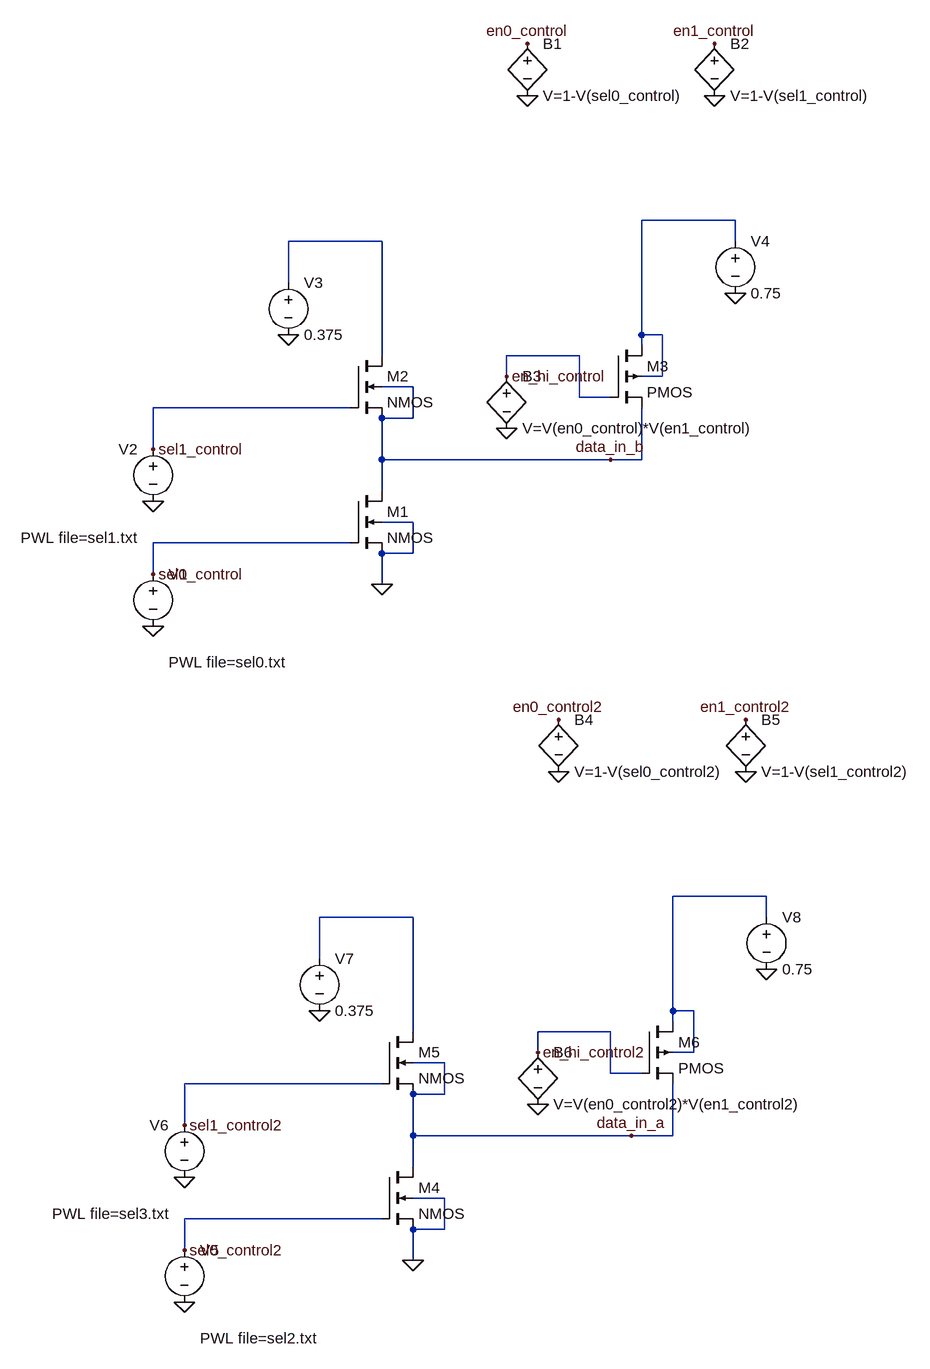
[diagram p0: schematic Draft4.asc]
Draft4.asc, the LTspice schematic file:
Version 4
SHEET 1 880 1244
WIRE 368 -544 224 -544
WIRE -176 -512 -320 -512
WIRE 368 -512 368 -544
WIRE -320 -448 -320 -512
WIRE 224 -368 224 -544
WIRE 256 -368 224 -368
WIRE 224 -352 224 -368
WIRE -176 -336 -176 -512
WIRE 128 -336 16 -336
WIRE 16 -304 16 -336
WIRE 256 -304 256 -368
WIRE 256 -304 224 -304
WIRE -128 -288 -176 -288
WIRE 128 -272 128 -336
WIRE 176 -272 128 -272
WIRE -224 -256 -528 -256
WIRE -128 -240 -128 -288
WIRE -128 -240 -176 -240
WIRE -528 -192 -528 -256
WIRE -176 -176 -176 -240
WIRE 176 -176 -176 -176
WIRE 224 -176 224 -256
WIRE 224 -176 176 -176
WIRE -176 -128 -176 -176
WIRE -128 -80 -176 -80
WIRE -224 -48 -528 -48
WIRE -128 -32 -128 -80
WIRE -128 -32 -176 -32
WIRE -528 0 -528 -48
WIRE -176 16 -176 -32
WIRE 416 496 272 496
WIRE -128 528 -272 528
WIRE 416 528 416 496
WIRE -272 592 -272 528
WIRE 272 672 272 496
WIRE 304 672 272 672
WIRE 272 688 272 672
WIRE -128 704 -128 528
WIRE 176 704 64 704
WIRE 64 736 64 704
WIRE 304 736 304 672
WIRE 304 736 272 736
WIRE -80 752 -128 752
WIRE 176 768 176 704
WIRE 224 768 176 768
WIRE -176 784 -480 784
WIRE -80 800 -80 752
WIRE -80 800 -128 800
WIRE -480 848 -480 784
WIRE -128 864 -128 800
WIRE 208 864 -128 864
WIRE 272 864 272 784
WIRE 272 864 208 864
WIRE -128 912 -128 864
WIRE -80 960 -128 960
WIRE -176 992 -480 992
WIRE -80 1008 -80 960
WIRE -80 1008 -128 1008
WIRE -480 1040 -480 992
WIRE -128 1056 -128 1008
FLAG -528 0 sel0_control
FLAG -528 -112 0
FLAG -528 80 0
FLAG -528 -192 sel1_control
FLAG 48 -736 0
FLAG 48 -816 en0_control
FLAG 336 -736 0
FLAG 336 -816 en1_control
FLAG 16 -304 en_hi_control
FLAG 16 -224 0
FLAG -176 16 0
FLAG -320 -368 0
FLAG 368 -432 0
FLAG -480 1040 sel0_control2
FLAG -480 928 0
FLAG -480 1120 0
FLAG -480 848 sel1_control2
FLAG 96 304 0
FLAG 96 224 en0_control2
FLAG 384 304 0
FLAG 384 224 en1_control2
FLAG 64 736 en_hi_control2
FLAG 64 816 0
FLAG -128 1056 0
FLAG -272 672 0
FLAG 416 608 0
FLAG 208 864 data_in_a
FLAG 176 -176 data_in_b
SYMBOL voltage -528 -16 R0
WINDOW 3 24 152 Left 2
WINDOW 123 0 0 Left 0
WINDOW 39 24 124 Left 2
SYMATTR Value PWL file=sel0.txt
SYMATTR InstName V1
SYMBOL voltage -528 -208 M0
WINDOW 3 24 152 Left 2
WINDOW 123 0 0 Left 0
WINDOW 39 24 124 Left 2
SYMATTR Value PWL file=sel1.txt
SYMATTR InstName V2
SYMBOL bv 48 -832 R0
SYMATTR InstName B1
SYMATTR Value V=1-V(sel0_control)
SYMBOL bv 336 -832 R0
SYMATTR InstName B2
SYMATTR Value V=1-V(sel1_control)
SYMBOL bv 16 -320 R0
SYMATTR InstName B3
SYMATTR Value V=V(en0_control)*V(en1_control)
SYMBOL nmos4 -224 -128 R0
SYMATTR InstName M1
SYMATTR Value2 l=45n w=1.0u
SYMBOL nmos4 -224 -336 R0
SYMATTR InstName M2
SYMATTR Value2 l=45n w=1.0u
SYMBOL voltage -320 -464 R0
WINDOW 123 0 0 Left 0
WINDOW 39 0 0 Left 0
SYMATTR InstName V3
SYMATTR Value 0.375
SYMBOL pmos4 176 -352 R0
SYMATTR InstName M3
SYMATTR Value2 l=45n w=1.0u
SYMBOL voltage 368 -528 R0
WINDOW 123 0 0 Left 0
WINDOW 39 0 0 Left 0
SYMATTR InstName V4
SYMATTR Value 0.75
SYMBOL voltage -480 1024 R0
WINDOW 3 24 152 Left 2
WINDOW 123 0 0 Left 0
WINDOW 39 24 124 Left 2
SYMATTR Value PWL file=sel2.txt
SYMATTR InstName V5
SYMBOL voltage -480 832 M0
WINDOW 3 24 152 Left 2
WINDOW 123 0 0 Left 0
WINDOW 39 24 124 Left 2
SYMATTR Value PWL file=sel3.txt
SYMATTR InstName V6
SYMBOL bv 96 208 R0
SYMATTR InstName B4
SYMATTR Value V=1-V(sel0_control2)
SYMBOL bv 384 208 R0
SYMATTR InstName B5
SYMATTR Value V=1-V(sel1_control2)
SYMBOL bv 64 720 R0
SYMATTR InstName B6
SYMATTR Value V=V(en0_control2)*V(en1_control2)
SYMBOL nmos4 -176 912 R0
SYMATTR InstName M4
SYMATTR Value2 l=45n w=1.0u
SYMBOL nmos4 -176 704 R0
SYMATTR InstName M5
SYMATTR Value2 l=45n w=1.0u
SYMBOL voltage -272 576 R0
WINDOW 123 0 0 Left 0
WINDOW 39 0 0 Left 0
SYMATTR InstName V7
SYMATTR Value 0.375
SYMBOL pmos4 224 688 R0
SYMATTR InstName M6
SYMATTR Value2 l=45n w=1.0u
SYMBOL voltage 416 512 R0
WINDOW 123 0 0 Left 0
WINDOW 39 0 0 Left 0
SYMATTR InstName V8
SYMATTR Value 0.75

The netlist it stands for:
* Draft4.asc
V1 sel0_control 0 PWL file=sel0.txt
V2 sel1_control 0 PWL file=sel1.txt
B1 en0_control 0 V=1-V(sel0_control)
B2 en1_control 0 V=1-V(sel1_control)
B3 en_hi_control 0 V=V(en0_control)*V(en1_control)
M1 data_in_b sel0_control 0 0 NMOS l=45n w=1.0u
M2 N002 sel1_control data_in_b data_in_b NMOS l=45n w=1.0u
V3 N002 0 0.375
M3 N001 en_hi_control data_in_b N001 PMOS l=45n w=1.0u
V4 N001 0 0.75
V5 sel0_control2 0 PWL file=sel2.txt
V6 sel1_control2 0 PWL file=sel3.txt
B4 en0_control2 0 V=1-V(sel0_control2)
B5 en1_control2 0 V=1-V(sel1_control2)
B6 en_hi_control2 0 V=V(en0_control2)*V(en1_control2)
M4 data_in_a sel0_control2 0 0 NMOS l=45n w=1.0u
M5 N004 sel1_control2 data_in_a data_in_a NMOS l=45n w=1.0u
V7 N004 0 0.375
M6 N003 en_hi_control2 data_in_a N003 PMOS l=45n w=1.0u
V8 N003 0 0.75
.model NMOS NMOS
.model PMOS PMOS
.lib standard.mos
.backanno
.end